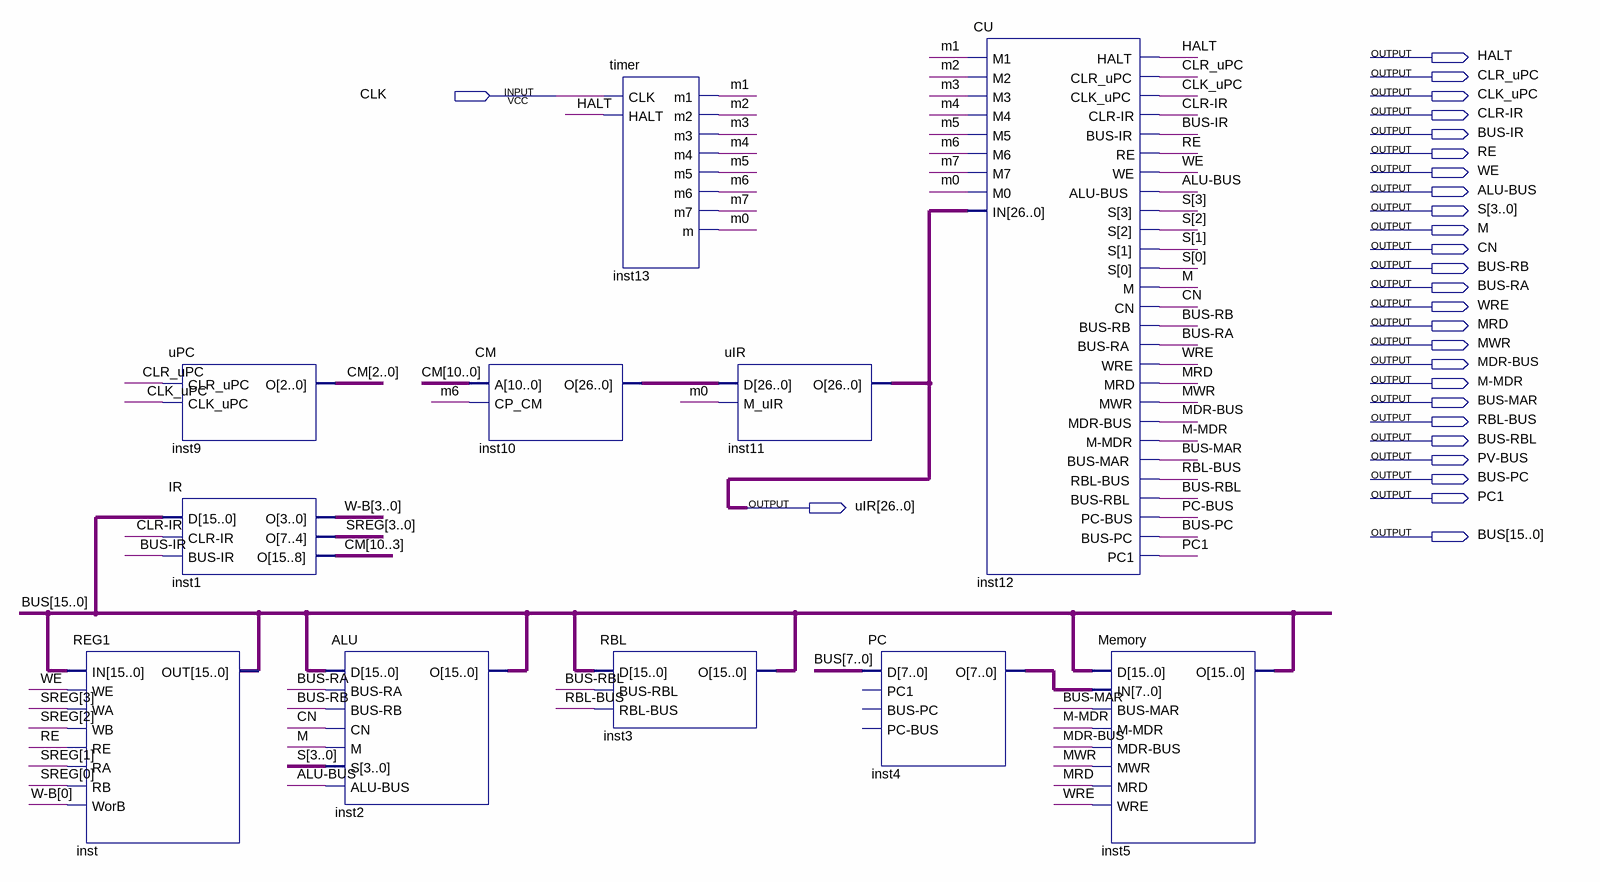
[diagram p0: schematic sheet]
// Quartus schematic CPUU.bdf as structural Verilog: 11 symbols, 27 pins
module CPUU (
  input  CLK,
  output HALT,
  output CLR_uPC,
  output CLK_uPC,
  output \CLR-IR ,
  output \BUS-IR ,
  output RE,
  output WE,
  output \ALU-BUS ,
  output [3:0] S,
  output M,
  output CN,
  output \BUS-RB ,
  output \BUS-RA ,
  output WRE,
  output MRD,
  output MWR,
  output \MDR-BUS ,
  output \M-MDR ,
  output \BUS-MAR ,
  output \RBL-BUS ,
  output \BUS-RBL ,
  output \PV-BUS ,
  output \BUS-PC ,
  output PC1,
  output [26:0] uIR,
  output [15:0] BUS
);

  wire m0, m1, m2, m3, m4, m5, m6, m7, \PC-BUS ;
  wire [3:0] SREG, \W-B ;
  wire [7:0] inst4_o;
  wire [10:0] CM;
  wire [26:0] inst10_o;

  REG1 inst (
    .IN(BUS), .WE(WE), .WA(SREG[3]), .WB(SREG[2]), .RE(RE), .RA(SREG[1]), .RB(SREG[0]), .WorB(\W-B [0]),
    .OUT(BUS));
  uPC inst9 (.CLR_uPC(CLR_uPC), .CLK_uPC(CLK_uPC), .O(CM[2:0]));
  IR inst1 (.D(BUS), .\CLR-IR (\CLR-IR ), .\BUS-IR (\BUS-IR ), .O({CM[10:3], SREG, \W-B }));
  ALU inst2 (.D(BUS), .\BUS-RA (\BUS-RA ), .\BUS-RB (\BUS-RB ), .CN(CN), .M(M), .S(S), .\ALU-BUS (\ALU-BUS ), .O(BUS));
  CM inst10 (.A(CM), .CP_CM(m6), .O(inst10_o));
  timer inst13 (.CLK(CLK), .HALT(HALT), .m1(m1), .m2(m2), .m3(m3), .m4(m4), .m5(m5), .m6(m6), .m7(m7), .m(m0));
  RBL inst3 (.D(BUS), .\BUS-RBL (\BUS-RBL ), .\RBL-BUS (\RBL-BUS ), .O(BUS));
  uIR inst11 (.D(inst10_o), .M_uIR(m0), .O(uIR));
  PC inst4 (.D(BUS[7:0]), .O(inst4_o));  // open: PC1, BUS-PC, PC-BUS
  CU inst12 (
    .M1(m1), .M2(m2), .M3(m3), .M4(m4), .M5(m5), .M6(m6), .M7(m7), .M0(m0), .IN(uIR), .HALT(HALT),
    .CLR_uPC(CLR_uPC), .CLK_uPC(CLK_uPC), .\CLR-IR (\CLR-IR ), .\BUS-IR (\BUS-IR ), .RE(RE), .WE(WE),
    .\ALU-BUS (\ALU-BUS ), .S(S), .M(M), .CN(CN), .\BUS-RB (\BUS-RB ), .\BUS-RA (\BUS-RA ), .WRE(WRE),
    .MRD(MRD), .MWR(MWR), .\MDR-BUS (\MDR-BUS ), .\M-MDR (\M-MDR ), .\BUS-MAR (\BUS-MAR ),
    .\RBL-BUS (\RBL-BUS ), .\BUS-RBL (\BUS-RBL ), .\PC-BUS (\PC-BUS ), .\BUS-PC (\BUS-PC ), .PC1(PC1));
  Memory inst5 (
    .D(BUS), .IN(inst4_o), .\BUS-MAR (\BUS-MAR ), .\M-MDR (\M-MDR ), .\MDR-BUS (\MDR-BUS ), .MWR(MWR),
    .MRD(MRD), .WRE(WRE), .O(BUS));
endmodule
